# Altium schematic sheet CLK_DS1391U_RTC.SchDoc: SPI Real Time Clock
size A4; Organization: Altium Limited.; Address1: Level 3, 12a Rodborough Rd; Address2: Frenchs Forest 2086; Address3: NSW; Address4: AUSTRALIA; Revision: 6; SheetNumber: 10; SheetTotal: 64; PageSetup: Record=PageOptions|CenterHorizontal=True|CenterVertical=True|PrintScale=2.81|XCorrection=1.00|YCorrection=1.00|PrintKind=0|BorderSize=5000000|LeftOffset=0|BottomOffset=0|Orientation=2|PaperLength=1000|PaperWidth=1000|Scale=100|PaperSource=7|PrintQuality=-4|MediaType=1|DitherType=10|PaperKind=A1 (594 x 841mm)|PrintScaleMode=1
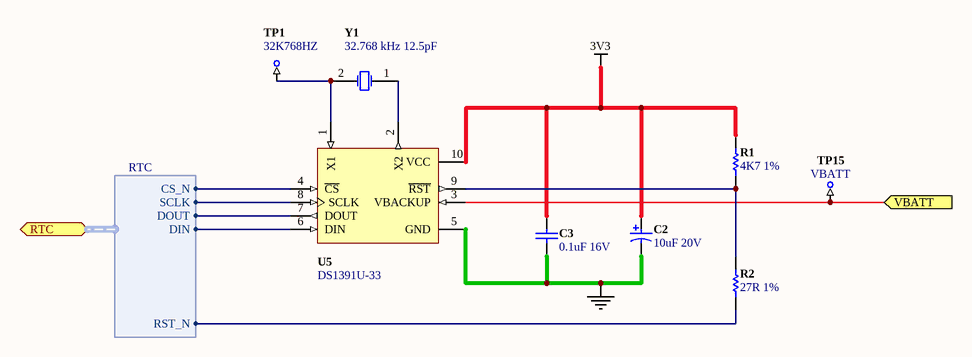
[diagram p0: CLK_DS1391U_RTC.SchDoc]

## Parts
C2  10uF 20V  [CAPC3528-STAR]
C3  0.1uF 16V  [CAPC1005-STAR]
R1  4K7 1%  [RESC1005-STAR]
R2  27R 1%  [RESC1005-STAR]
TP1  32K768HZ  [TestPin]  (no BOM)
TP15  VBATT  [TestPin]  (no BOM)
U5  DS1391U-33  [SSOP50P490-10]
Y1  32.768 kHz 12.5pF  [XTAL QSC26 QSMC-200S Combi]

## Ports
RTC (harness RTC), VBATT (in)

## Harnesses
RTC: CS_N, DIN, DOUT, RST_N, SCLK

## Nets
3V3: C2.1 C3.1 R1.2 U5.10(VCC)
GND: C2.2 C3.2 U5.5(GND)
VBATT: TP15.1 U5.3(VBACKUP) ; port VBATT
NetR1_1: R1.1 R2.2 U5.9(~{RST})
NetR2_1: R2.1 ; port RTC.RST_N
NetTP1_1: TP1.1 U5.1(X1) Y1.2(OSC2)
NetU5_2: U5.2(X2) Y1.1(OSC1)
NetU5_4: U5.4(~{CS}) ; port RTC.CS_N
NetU5_6: U5.6(DIN) ; port RTC.DIN
NetU5_7: U5.7(DOUT) ; port RTC.DOUT
NetU5_8: U5.8(SCLK) ; port RTC.SCLK

## Notes on the sheet
- Sheet Title
- Project Title
- Size:
- Date:
- A4
- Assy:
- Time:
- Sheet
- Revision:
- of
- File:

## Library data of the parts
C2 = D-101-0007: Capacitor, Tantalum, 10uF 10% 20V MCCT-B (3528); Polarity: Polarized; Category: Capacitor; Capacitance: 10 uF; Mounting Technology: Surface Mount; Rated Voltage: 20 V; Status: Production; Technology: Tantalum; Tolerance: 10 %
C3 = D-101-0080: Capacitor, Ceramic, 0.1uF 10% 16V 0402 (1005) X7R; Polarity: Non-Polarized; Category: Capacitor; Capacitance: 0.1 uF; Dielectric: X7R; Mounting Technology: Surface Mount; Rated Voltage: 16 V; Status: Production; Technology: Ceramic; Tolerance: 10 %
R1 = D-100-0088: Resistor, 4K7 1% 0402 (1005); Power Rating: 63 mW; Resistance: 4.7 K; Category: Resistor; Mounting Technology: Surface Mount; Status: Production; Tolerance: 1 %
R2 = D-100-0108: Resistor, 27R 1% 0402 (1005); Power Rating: 63 mW; Category: Resistor; Mounting Technology: Surface Mount; Resistance: 27 R; Status: Production; Tolerance: 1 %
TP1 TP15 = D-006-0000: Test Point, PCB Mount with Silkscreen Box; Category: Test-Point; Status: Production
U5 = D-206-0001: DS1391U-33, SPI Real-Time Clock with Trickle Charger, 3.3V, 10-Pin uMax/uSOP; Status: Production; Category: IC-Clock
Y1 = D-103-0002: Crystal, 32.768 KHz Surface Mount; Category: Crystal; Mounting Technology: Surface Mount; Nominal Fequency: 32.768 KHz; Status: Production